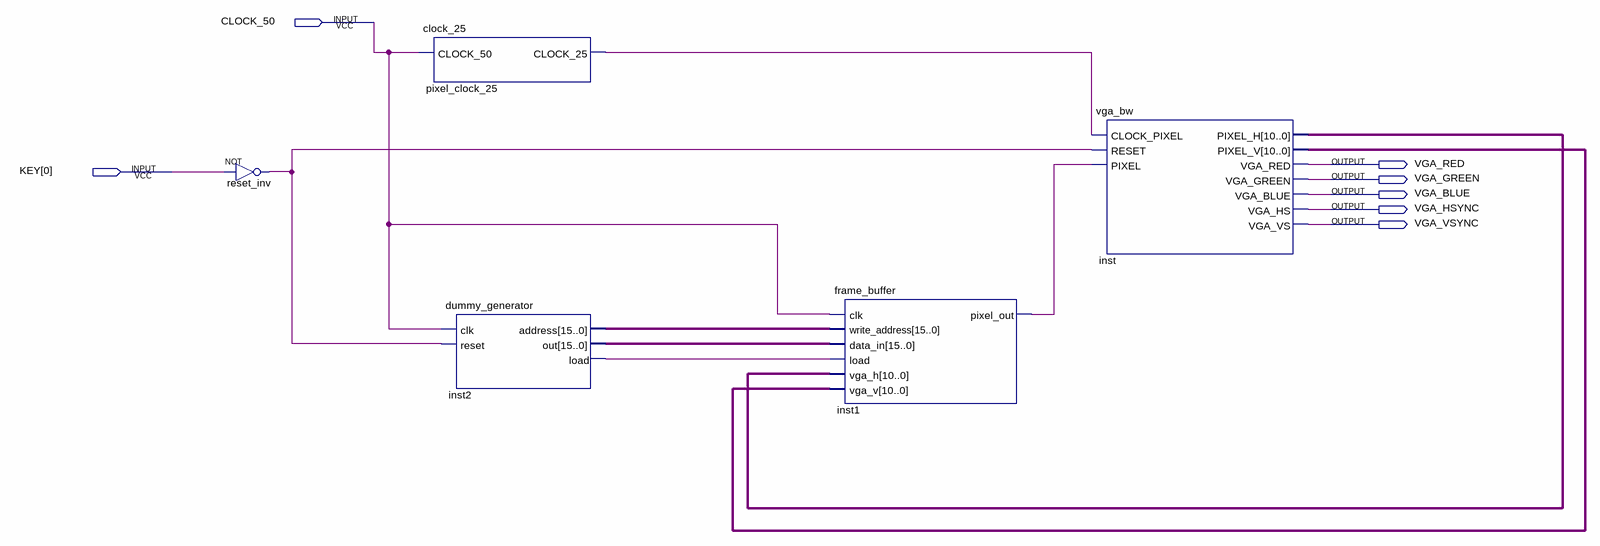
[diagram p0: schematic sheet]
// Quartus schematic vga.bdf as structural Verilog: 5 symbols, 7 pins
module vga (
  input  CLOCK_50,
  input  [0:0] KEY,
  output VGA_RED,
  output VGA_GREEN,
  output VGA_BLUE,
  output VGA_HSYNC,
  output VGA_VSYNC
);

  wire inst1_pixel_out, inst2_load, pixel_clock_25_clock_25, reset_inv_out;
  wire [10:0] inst_pixel_h, inst_pixel_v;
  wire [15:0] inst2_address, inst2_out;

  not reset_inv (reset_inv_out, KEY[0]);
  clock_25 pixel_clock_25 (.CLOCK_50(CLOCK_50), .CLOCK_25(pixel_clock_25_clock_25));
  dummy_generator inst2 (
    .clk(CLOCK_50), .reset(reset_inv_out), .address(inst2_address), .out(inst2_out), .load(inst2_load));
  frame_buffer inst1 (
    .clk(CLOCK_50), .write_address(inst2_address), .data_in(inst2_out), .load(inst2_load),
    .vga_h(inst_pixel_h), .vga_v(inst_pixel_v), .pixel_out(inst1_pixel_out));
  vga_bw inst (
    .CLOCK_PIXEL(pixel_clock_25_clock_25), .RESET(reset_inv_out), .PIXEL(inst1_pixel_out),
    .PIXEL_H(inst_pixel_h), .PIXEL_V(inst_pixel_v), .VGA_RED(VGA_RED), .VGA_GREEN(VGA_GREEN),
    .VGA_BLUE(VGA_BLUE), .VGA_HS(VGA_HSYNC), .VGA_VS(VGA_VSYNC));
endmodule
